# EAGLE design trans-emu (EAGLE 9.6.2)
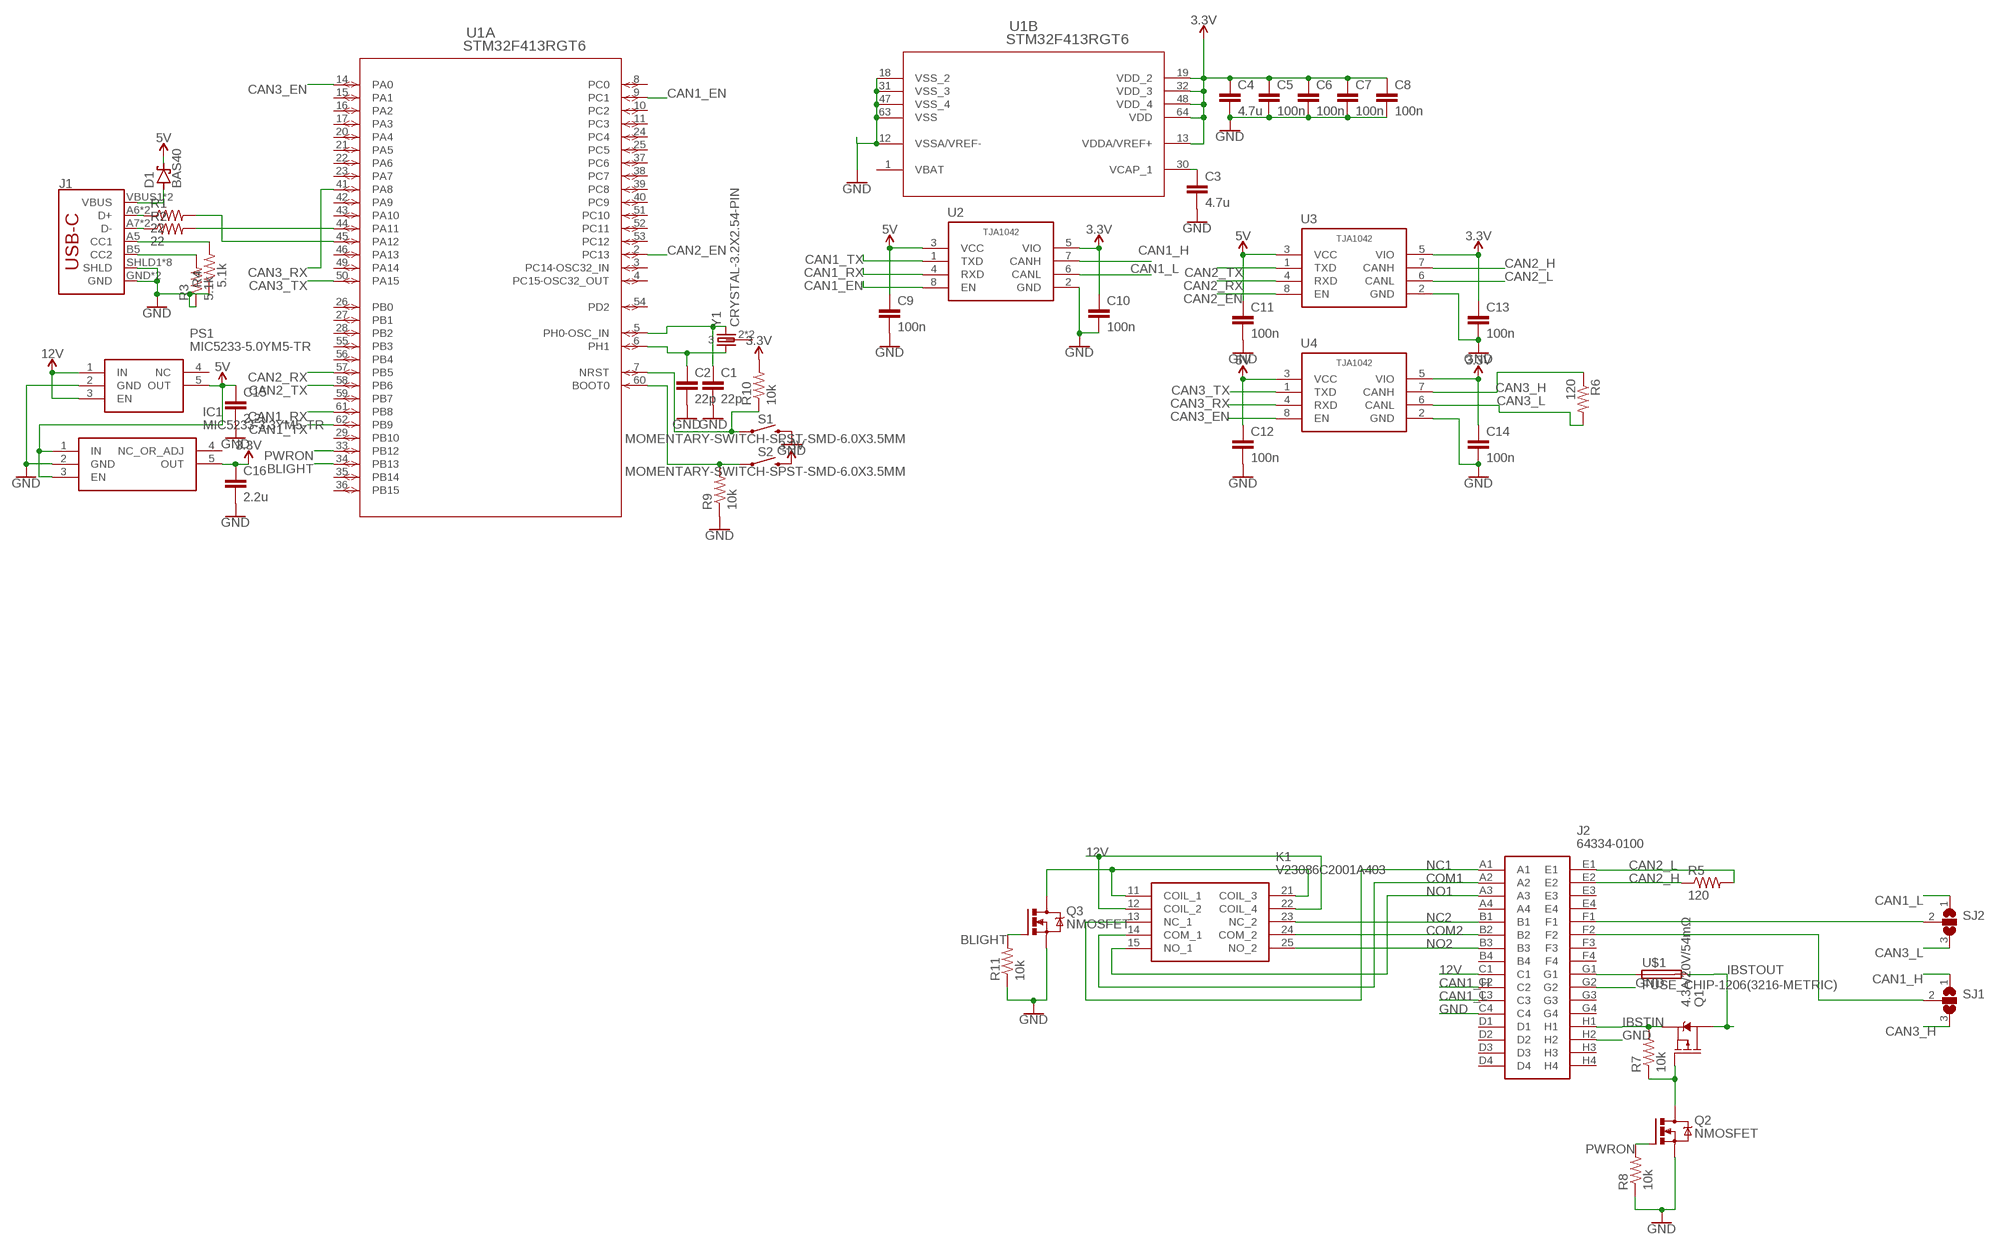
[diagram p0: schematic, sheet 1]

## Parts
C1  22p  C0603  [0603-C]
C2  22p  C0603  [0603-C]
C3  4.7u  C0603  [0603-C]
C4  4.7u  C0603  [0603-C]
C5  100n  C0603  [0603-C]
C6  100n  C0603  [0603-C]
C7  100n  C0603  [0603-C]
C8  100n  C0603  [0603-C]
C9  100n  C0603  [0603-C]
C10  100n  C0603  [0603-C]
C11  100n  C0603  [0603-C]
C12  100n  C0603  [0603-C]
C13  100n  C0603  [0603-C]
C14  100n  C0603  [0603-C]
C15  2.2u  C0603  [0603-C]
C16  2.2u  C0603  [0603-C]
D1  BAS40  [SOT23]
IC1  MIC5233-3.3YM5-TR  [SOT95P280X145-5N]
J1  USB-C-BREAKOUT_SPARKFUN-CONNECTORS_USB_C16PIN  [USB-C-BREAKOUT_SPARKFUN-CONNECTORS_USB-C-16P]
J2  64334-0100  [643340100]
K1  V23086C2001A403  [V23086C2001A403]
PS1  MIC5233-5.0YM5-TR  [SOT95P280X145-5N]
Q1  4.3A/20V/54mΩ  MOSFET_PCH-IRLML2244  [SOT23-3]
Q2  NMOSFET  NMOSFETSOT23  [SOT23]
Q3  NMOSFET  NMOSFETSOT23  [SOT23]
R1  22  R0402  [0402-R]
R2  22  R0402  [0402-R]
R3  5.1k  R0402  [0402-R]
R4  5.1k  R0402  [0402-R]
R5  120  R0402  [0402-R]
R6  120  R0402  [0402-R]
R7  10k  R0402  [0402-R]
R8  10k  R0402  [0402-R]
R9  10k  R0402  [0402-R]
R10  10k  R0402  [0402-R]
R11  10k  R0402  [0402-R]
S1  MOMENTARY-SWITCH-SPST-SMD-6.0X3.5MM  [TACTILE_SWITCH_SMD_6.0X3.5MM]
S2  MOMENTARY-SWITCH-SPST-SMD-6.0X3.5MM  [TACTILE_SWITCH_SMD_6.0X3.5MM]
SJ1  SJ2W  [SJ_2]
SJ2  SJ2W  [SJ_2]
U1  STM32F413RGT6  [LQFP64-10X10MM]
U2  TJA1042  [NXP_SEMICONDUCTORS_TJA1042T-3-CM_118_0]
U3  TJA1042  [NXP_SEMICONDUCTORS_TJA1042T-3-CM_118_0]
U4  TJA1042  [NXP_SEMICONDUCTORS_TJA1042T-3-CM_118_0]
U$1  FUSE_CHIP-1206(3216-METRIC)  [FUSC3215X82N]
Y1  CRYSTAL-3.2X2.54-PIN  [XTAL-3.2X2.5]

## Nets
3.3V: C4.1 C5.1 C6.1 C7.1 C8.1 C10.1 C13.1 C14.1 C16.1 IC1.5(OUT) R10.2 S2.2 U1.13(B:VDDA/VREF+) U1.19(B:VDD_2) U1.32(B:VDD_3) U1.48(B:VDD_4) U1.64(B:VDD) U2.5(VIO) U3.5(VIO) U4.5(VIO)
5V: C9.1 C11.1 C12.1 C15.1 D1.3(C) IC1.1(IN) IC1.3(EN) PS1.5(OUT) U2.3(VCC) U3.3(VCC) U4.3(VCC)
12V: J2.C1 K1.12(COIL_2) K1.22(COIL_4) PS1.1(IN) PS1.3(EN)
BLIGHT: Q3.1(G) R11.2 U1.34(A:PB13)
CAN1_EN: U1.9(A:PC1) U2.8(EN)
CAN1_H: J2.C2 SJ1.1 U2.7(CANH)
CAN1_L: J2.C3 SJ2.1 U2.6(CANL)
CAN1_RX: U1.61(A:PB8) U2.4(RXD)
CAN1_TX: U1.62(A:PB9) U2.1(TXD)
CAN2_EN: U1.2(A:PC13) U3.8(EN)
CAN2_H: J2.E2 R5.1 U3.7(CANH)
CAN2_L: J2.E1 R5.2 U3.6(CANL)
CAN2_RX: U1.57(A:PB5) U3.4(RXD)
CAN2_TX: U1.58(A:PB6) U3.1(TXD)
CAN3_EN: U1.14(A:PA0) U4.8(EN)
CAN3_H: R6.1 SJ1.3 U4.7(CANH)
CAN3_L: R6.2 SJ2.3 U4.6(CANL)
CAN3_RX: U1.41(A:PA8) U4.4(RXD)
CAN3_TX: U1.50(A:PA15) U4.1(TXD)
COM1: J2.A2 K1.14(COM_1)
COM2: J2.B2 K1.24(COM_2)
GND: C1.2 C2.2 C3.2 C4.2 C5.2 C6.2 C7.2 C8.2 C9.2 C10.2 C11.2 C12.2 C13.2 C14.2 C15.2 C16.2 IC1.2(GND) J1.GND J1.GND2(GND) J1.SHLD1(SHLD) J1.SHLD2(SHLD) J1.SHLD3(SHLD) J1.SHLD4(SHLD) J1.SHLD5(SHLD) J1.SHLD6(SHLD) J1.SHLD7(SHLD) J1.SHLD8(SHLD) J2.C4 J2.G2 J2.H2 PS1.2(GND) Q2.2(S) Q3.2(S) R3.1 R4.1 R8.1 R9.1 R11.1 S1.2 U1.12(B:VSSA/VREF-) U1.18(B:VSS_2) U1.31(B:VSS_3) U1.47(B:VSS_4) U1.63(B:VSS) U2.2(GND) U3.2(GND) U4.2(GND)
IBSTIN: J2.H1 Q1.2(S) R7.2
IBSTOUT: Q1.3(D) U$1.2
N$1: C1.1 U1.5(A:PH0-OSC_IN) Y1.3
N$2: C2.1 U1.6(A:PH1) Y1.1
N$3: R2.2 U1.44(A:PA11)
N$4: R1.2 U1.45(A:PA12)
N$5: D1.1(A) J1.VBUS1(VBUS) J1.VBUS2(VBUS)
N$6: J1.A5(CC1) R4.2
N$7: J1.B5(CC2) R3.2
N$8: R10.1 S1.1 U1.7(A:NRST)
N$9: R9.2 S2.1 U1.60(A:BOOT0)
N$10: J1.A6(D+) J1.B6(D+) R1.1
N$11: J1.A7(D-) J1.B7(D-) R2.1
N$12: J2.F2 SJ1.2
N$13: C3.1 U1.30(B:VCAP_1)
N$14: J2.F1 SJ2.2
N$16: Q1.1(G) Q2.3(D) R7.1
N$17: K1.11(COIL_1) K1.21(COIL_3) Q3.3(D)
N$18: J2.G1 U$1.1
NC1: J2.A1 K1.13(NC_1)
NC2: J2.B1 K1.23(NC_2)
NO1: J2.A3 K1.15(NO_1)
NO2: J2.B3 K1.25(NO_2)
PWRON: Q2.1(G) R8.2 U1.33(A:PB12)
Unconnected: IC1.4(NC_OR_ADJ) J2.A4 J2.B4 J2.D1 J2.D2 J2.D3 J2.D4 J2.E3 J2.E4 J2.F3 J2.F4 J2.G3 J2.G4 J2.H3 J2.H4 PS1.4(NC) U1.3(A:PC14-OSC32_IN) U1.4(A:PC15-OSC32_OUT) U1.8(A:PC0) U1.10(A:PC2) U1.11(A:PC3) U1.15(A:PA1) U1.16(A:PA2) U1.17(A:PA3) U1.20(A:PA4) U1.21(A:PA5) U1.22(A:PA6) U1.23(A:PA7) U1.24(A:PC4) U1.25(A:PC5) U1.26(A:PB0) U1.27(A:PB1) U1.28(A:PB2) U1.29(A:PB10) U1.35(A:PB14) U1.36(A:PB15) U1.37(A:PC6) U1.38(A:PC7) U1.39(A:PC8) U1.40(A:PC9) U1.42(A:PA9) U1.43(A:PA10) U1.46(A:PA13) U1.49(A:PA14) U1.51(A:PC10) U1.52(A:PC11) U1.53(A:PC12) U1.54(A:PD2) U1.55(A:PB3) U1.56(A:PB4) U1.59(A:PB7) Y1.2 Y1.4

## Power pins joined to a net without a drawn wire
VBAT: U1.1(B:VBAT)

## Library data of the parts
C1-C16 = comma.ai:C
D1 = diode:BAS40: Silicon Schottky Diodes General-purpose diode for high-speed switching
IC1 = SamacSys_Parts:MIC5233-3.3YM5-TR: High Input Voltage Low IQ UCAP LDO Regulator Source: Datasheet <http://ww1.microchip.com/downloads/en/DeviceDoc/MIC5233-Data-Sheet-DS20006033D.pdf>; DESCRIPTION: High Input Voltage Low IQ UCAP LDO Regulator; HEIGHT: 1.45mm; MANUFACTURER_NAME: Microchip; MANUFACTURER_PART_NUMBER: MIC5233-3.3YM5-TR; MOUSER_PART_NUMBER: 998-MIC5233-3.3YM5TR; MOUSER_PRICE-STOCK: https://www.mouser.co.uk/ProductDetail/Microchip-Technology-Micrel/MIC5233-33YM5-TR?qs=U6T8BxXiZAWDhshLMgpaLQ%3D%3D
J1 = ROTR-Wireless:USB-C-BREAKOUT_SPARKFUN-CONNECTORS_USB_C: USB Type C 16Pin Connector Super Speed pins not available on the 16-pin purely SMD connector so this part is best for USB 2.0 implementations. D1 and D2 are tied together enabling D+/- no matter which way the cable is plugged into the connector. The two channel configuration pins (CC1/2) are exposed. These are normally connected to ground via 5.1k resistors but can be reconfigured for high current/high power applications.; PROD_ID: CONN-14122
J2 = 64334-0100:64334-0100: Molex CMC Series, 64334 Series Number, 4 Row 32 Way Through Hole Plug Header, with Solder Termination Method Source: Datasheet <https://www.molex.com/pdm_docs/sd/643340100_sd.pdf>; DESCRIPTION: Molex CMC Series, 64334 Series Number, 4 Row 32 Way Through Hole Plug Header, with Solder Termination Method; HEIGHT: 24.9mm; MANUFACTURER_NAME: Molex; MANUFACTURER_PART_NUMBER: 64334-0100; MOUSER_PART_NUMBER: 538-64334-0100; MOUSER_PRICE-STOCK: https://www.mouser.co.uk/ProductDetail/Molex/64334-0100/?qs=1v6ai6VCYQB4FZKAqE1dxQ%3D%3D
K1 = SamacSys_Parts:V23086C2001A403: DPDT PCB Mount Non-Latching Relay, 12V dc Source: Datasheet <http://www.te.com/commerce/DocumentDelivery/DDEController?Action=showdoc&DocId=Data SheetV23086-X0000-A0020717pdfEnglishENG_DS_V23086-X0000-A002_0717.pdf1413009-9>; ARROW_PART_NUMBER: V23086C2001A403; ARROW_PRICE-STOCK: http://www.arrow.com/en/products/v23086c2001a403/te-connectivity; DESCRIPTION: DPDT PCB Mount Non-Latching Relay, 12V dc; HEIGHT: 10mm; MANUFACTURER_NAME: TE Connectivity; MANUFACTURER_PART_NUMBER: V23086C2001A403; MOUSER_PART_NUMBER: 571-1413009-9; MOUSER_PRICE-STOCK: https://www.mouser.co.uk/ProductDetail/TE-Connectivity-AMP/V23086C2001A403?qs=NEWnq6vH5Lf200SrWeC2iA%3D%3D
PS1 = SamacSys_Parts:MIC5233-5.0YM5-TR: MICROCHIP - MIC5233-5.0YM5-TR - LDO, REG, 36VIN, 0.1A, 5V, 2%, 5SOT23 Source: Datasheet <https://componentsearchengine.com/Datasheets/2/MIC5233-5.0YM5-TR.pdf>; DESCRIPTION: MICROCHIP - MIC5233-5.0YM5-TR - LDO, REG, 36VIN, 0.1A, 5V, 2%, 5SOT23; HEIGHT: 1.45mm; MANUFACTURER_NAME: Microchip; MANUFACTURER_PART_NUMBER: MIC5233-5.0YM5-TR; MOUSER_PART_NUMBER: 998-MIC5233-5.0YM5TR; MOUSER_PRICE-STOCK: https://www.mouser.co.uk/ProductDetail/Microchip-Technology-Micrel/MIC5233-50YM5-TR?qs=U6T8BxXiZAWSnpCHgrMajw%3D%3D
Q1 = SparkFun-DiscreteSemi:MOSFET_PCH: P-channel MOSFETs Voltage controlled devices that allow control of high current outputs. SparkFun Products: SparkFun ESP32 Thing <https://www.sparkfun.com/products/13907> SparkFun ESP8266 Thing <https://www.sparkfun.com/products/13231>; PROD_ID: TRANS-11153
Q2 Q3 = Transistor:NMOSFET: N-Channel MOSFET - Generic; CATEGORY: Transistor; SUB-CATEGORY: MOSFET; TYPE: N-Channel
R1-R11 = comma.ai:R
S1 S2 = SparkFun-Switches:MOMENTARY-SWITCH-SPST: Momentary Switch (Pushbutton) - SPST Normally-open (NO) SPST momentary switches (buttons, pushbuttons). Variants PTH-12MM - 12mm square, through-hole Momentary Pushbutton Switch - 12mm Square <https://www.sparkfun.com/products/9190> (COM-09190) PTH-6.0MM, PTH-6.0MM-KIT - 6.0mm square, through-hole Mini Pushbutton Switch <https://www.sparkfun.com/products/97> (COM-00097) KIT package intended for soldering kit's - only one side of pads' copper is exposed. PTH-RIGHT-ANGLE-KIT - Right-angle, through-hole Right Angle Tactile Button <https://www.sparkfun.com/products/10791> - Used on SparkFun BigTime Watch Kit <https://www.sparkfun.com/products/11734> SMD-12MM - 12mm square, surface-mount Tactile Button - SMD (12mm) <https://www.sparkfun.com/products/12993> (COM-12993) Used on SparkFun PicoBoard <https://www.sparkfun.com/products/11888> SMD-4.5MM - 4.5mm Square Trackball Switch Used on SparkFun Blackberry Trackballer Breakout <https://www.sparkfun.com/products/13169> SMD-4.6MMX2.8MM - 4.60mm x 2.80mm, surface mount Used on SparkFun SAMD21 Mini Breakout <https://www.sparkfun.com/products/13664> SMD-5.2MM, SMD-5.2-REDUNDANT - 5.2mm square, surface-mount Mini Pushbutton Switch - SMD <https://www.sparkfun.com/products/8720> (COM-08720) Used on Arduino Pro Mini <https://www.sparkfun.com/products/11114> REDUNDANT package connects both switch circuits together SMD-6.0X3.5MM - 6.0 x 3.5mm, surface mount Momentary Reset Switch SMD <https://www.sparkfun.com/products/8229> (COM-08229) SMD-6.2MM-TALL - 6.2mm square, surface mount Tactile Button - SMD (6mm) <https://www.sparkfun.com/products/12992> Used on SparkFun Digital Sandbox <https://www.sparkfun.com/products/12651> SMD-RIGHT-ANGLE - Right-angle, surface mount Used on SparkFun Block for Intel® Edison - Arduino <https://www.sparkfun.com/products/13036>; PROD_ID: SWCH-00815; SF_SKU: COM-08229
SJ1 SJ2 = jumper:SJ2W: SMD solder JUMPER
U1 = interceptor:STM32F413RGT6; BUILT_BY: EMA_UL_Team; COPYRIGHT: Copyright (C) 2018 Accelerated Designs. All rights reserved; MANUFACTURER_PART_NUMBER: STM32F413RGT6; SOURCELIBRARY: Updates_to_database_2020-10-19; VENDOR: STMicroelectronics
U2-U4 = CM,118:TJA1042
U$1 = Circuit-Protection:FUSE: Fuse - Generic; CATEGORY: Circuit-Protection; SUB-CATEGORY: Fuse
Y1 = comma.ai:CRYSTAL-3.2X2.5

## Board
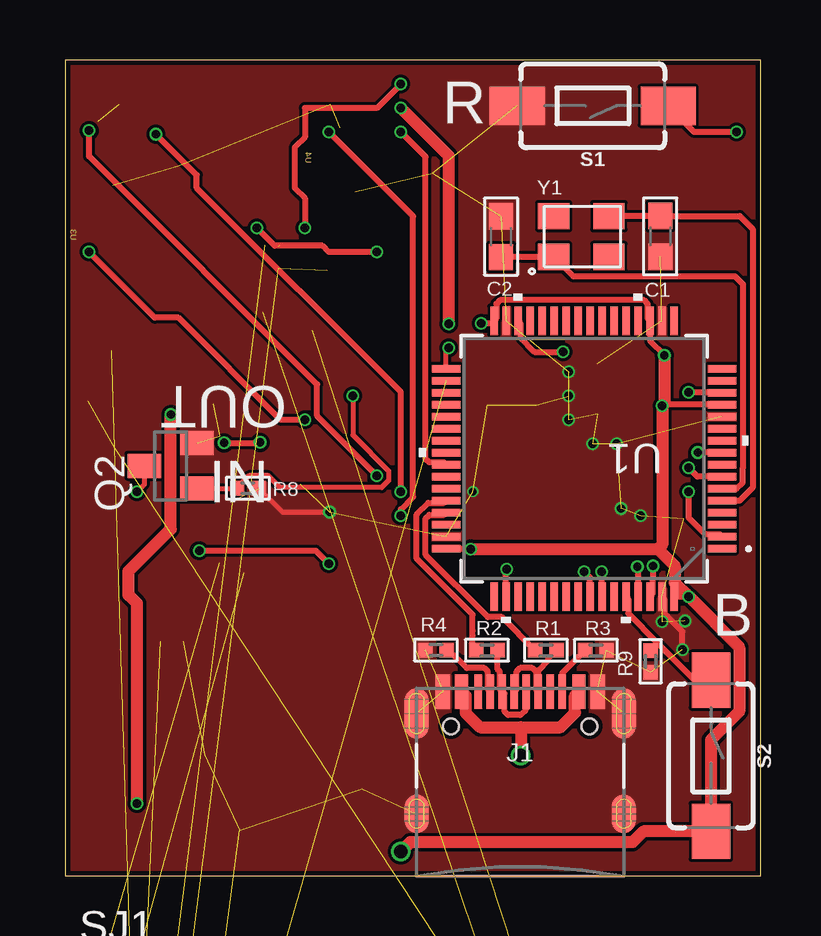
[diagram p1: board, top side]
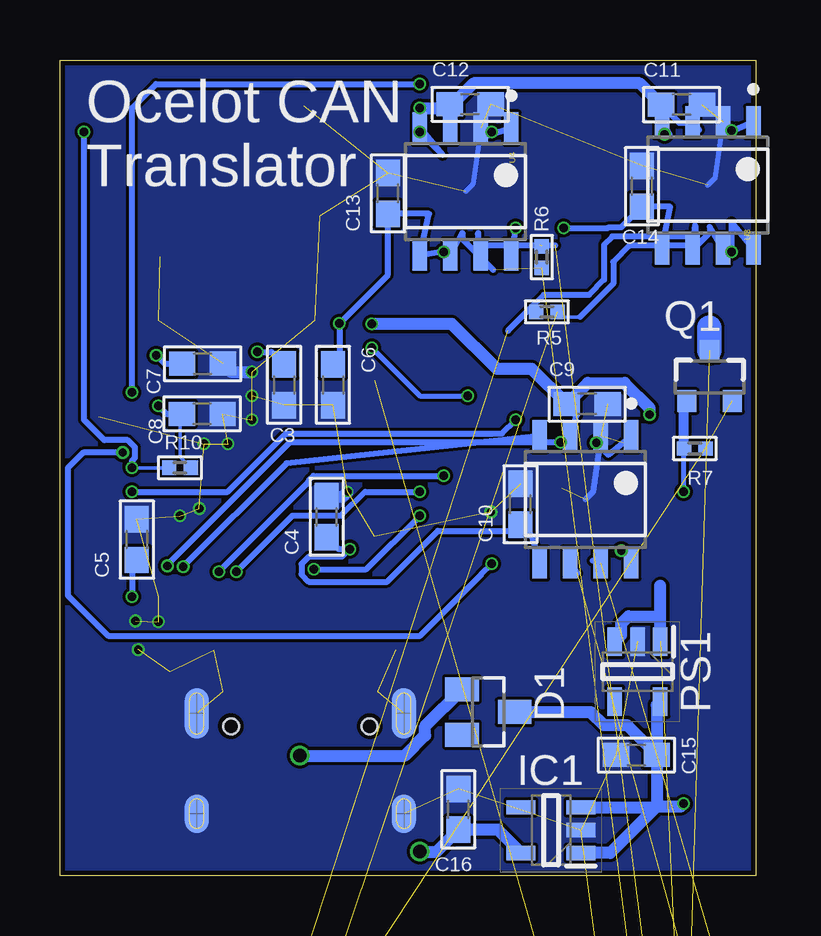
[diagram p2: board, bottom side, seen from below]

Size 29 x 34 mm. Coordinates in mm from the lower left corner, seen from the top.
Outline: 0,0 29,0 29,34 0,34 0,0
Copper layers (1*16): Top 0.035559375mm / dielectric 1.6mm / Bottom 0.035559375mm
Design rules "jlcpcb2layer": minimum track width 5mil, minimum drill 12mil, track to track 5mil, track to pad 5mil, pad to pad 5mil, via to via 5mil, smd to smd 5mil, copper to edge 8mil, drill to drill 6mil, minimum pad ring 5mil, minimum via ring 3mil, stop-mask expansion 2.5mil, vias tented up to drill 0mil, thermal gap 10mil

### Footprints (pad centres in the part's own frame; a part is rotated, then mirrored left to right if it is on the bottom)
0603-C = smd 1.1 x 1: 1 -0.85,0; 2 0.85,0
SOT23 = smd 1 x 1.4: 1 -0.95,-1.1; 2 0.95,-1.1; 3 0,1.1
SOT95P280X145-5N = smd 1.2 x 0.6: 1 -1.25,0.95; 2 -1.25,0; 3 -1.25,-0.95; 4 1.25,-0.95; 5 1.25,0.95
USB-C-BREAKOUT_SPARKFUN-CONNECTORS_USB-C-16P = smd 0.3 x 1.45: A5 -1.25,0; A6 -0.25,0; A7 0.25,0; A8 1.25,0; B5 1.75,0; B6 0.75,0; B7 -0.75,0; B8 -1.75,0 | smd 0.6 x 1.45: GND -3.225,0; GND2 3.225,0 | smd 1 x 2.1: SHLD1 -4.32,-0.915; SHLD2 4.32,-0.915 | smd 1 x 2.1 bottom: SHLD3 -4.32,-0.915; SHLD4 4.32,-0.915 | smd 1 x 1.6: SHLD5 -4.32,-5.095; SHLD8 4.32,-5.095 | smd 1 x 1.6 bottom: SHLD6 -4.32,-5.095; SHLD7 4.32,-5.095 | smd 0.55 x 1.45: VBUS1 -2.45,0; VBUS2 2.45,0 | hole 0.65: -2.89,-1.445; 2.89,-1.445
643340100 = drill 1.3 pad 1.95: A1 0,0; A2 0,-2.5; A3 0,-5; A4 0,-7.5; B1 2.5,0; B2 2.5,-2.5; B3 2.5,-5; B4 2.5,-7.5; C1 5,0; C2 5,-2.5; C3 5,-5; C4 5,-7.5; D1 7.5,0; D2 7.5,-2.5; D3 7.5,-5; D4 7.5,-7.5; E1 10,0; E2 10,-2.5; E3 10,-5; E4 10,-7.5; F1 12.5,0; F2 12.5,-2.5; F3 12.5,-5; F4 12.5,-7.5; G1 16,0; G2 16,-2.5; G3 16,-5; G4 16,-7.5; H1 19.7,0; H2 19.7,-2.5; H3 19.7,-5; H4 19.7,-7.5 | hole 2.3: -6.45,1; 26.15,1 | hole 4.1: -10.55,-2.85; 30.25,-2.85
V23086C2001A403 = drill 1.11 pad 1.665: 11 -2.585,-1.909; 12 -10.085,4.691; 21 2.585,1.091; 22 10.085,-5.509 | drill 1.45 pad 2.175: 13 -9.585,-5.509; 14 -1.585,-5.509; 23 9.585,4.751; 24 1.585,4.751; 25 9.585,1.751 | drill 1.25 pad 1.875: 15 -9.585,-2.509
SOT23-3 = smd 0.8 x 0.9: 1 -0.95,-1; 2 0.95,-1; 3 0,1.1
0402-R = smd 0.6 x 0.6: 1 -0.45,0; 2 0.45,0
TACTILE_SWITCH_SMD_6.0X3.5MM = smd 2.3 x 1.6: 1 -3.15,0; 2 3.15,0
SJ_2 = smd 1.168 x 1.6: 1 -1.524,0; 2 0,0; 3 1.524,0
LQFP64-10X10MM = smd 1.194 x 0.305: 1 -5.75,3.75; 2 -5.75,3.25; 3 -5.75,2.75; 4 -5.75,2.25; 5 -5.75,1.75; 6 -5.75,1.25; 7 -5.75,0.75; 8 -5.75,0.25; 9 -5.75,-0.25; 10 -5.75,-0.75; 11 -5.75,-1.25; 12 -5.75,-1.75; 13 -5.75,-2.25; 14 -5.75,-2.75; 15 -5.75,-3.25; 16 -5.75,-3.75; 33 5.75,-3.75; 34 5.75,-3.25; 35 5.75,-2.75; 36 5.75,-2.25; 37 5.75,-1.75; 38 5.75,-1.25; 39 5.75,-0.75; 40 5.75,-0.25; 41 5.75,0.25; 42 5.75,0.75; 43 5.75,1.25; 44 5.75,1.75; 45 5.75,2.25; 46 5.75,2.75; 47 5.75,3.25; 48 5.75,3.75 | smd 0.305 x 1.194: 17 -3.75,-5.75; 18 -3.25,-5.75; 19 -2.75,-5.75; 20 -2.25,-5.75; 21 -1.75,-5.75; 22 -1.25,-5.75; 23 -0.75,-5.75; 24 -0.25,-5.75; 25 0.25,-5.75; 26 0.75,-5.75; 27 1.25,-5.75; 28 1.75,-5.75; 29 2.25,-5.75; 30 2.75,-5.75; 31 3.25,-5.75; 32 3.75,-5.75; 49 3.75,5.75; 50 3.25,5.75; 51 2.75,5.75; 52 2.25,5.75; 53 1.75,5.75; 54 1.25,5.75; 55 0.75,5.75; 56 0.25,5.75; 57 -0.25,5.75; 58 -0.75,5.75; 59 -1.25,5.75; 60 -1.75,5.75; 61 -2.25,5.75; 62 -2.75,5.75; 63 -3.25,5.75; 64 -3.75,5.75
NXP_SEMICONDUCTORS_TJA1042T-3-CM_118_0 = smd 1.3 x 0.6: 1 -2.65,1.905; 2 -2.65,0.635; 3 -2.65,-0.635; 4 -2.65,-1.905; 5 2.65,-1.905; 6 2.65,-0.635; 7 2.65,0.635; 8 2.65,1.905
FUSC3215X82N = smd 1.165 x 1.814: 1 -1.475,0; 2 1.475,0
XTAL-3.2X2.5 = smd 1.3 x 1.1: 1 0,-1.8; 2 2.3,-1.8; 3 2.3,-0.1; 4 0,-0.1

### Placement (x,y rotation side)
C1  24.81,26.65 270 top
C2  18.18,26.63 90 top
C3  19.65,20.45 270 bottom
C4  17.88,14.96 90 bottom
C5  25.79,14.01 90 bottom
C6  17.62,20.45 270 bottom
C7  23.06,21.33 0 bottom
C8  23.07,19.25 0 bottom
C9  7.02,19.65 0 bottom
C10  9.8,15.48 90 bottom
C11  3.08,32.13 0 bottom
C12  11.9,32.15 0 bottom
C13  15.33,28.44 90 bottom
C14  4.73,28.73 90 bottom
C15  4.96,5.03 180 bottom
C16  12.39,2.76 90 bottom
D1  11.14,6.82 270 bottom
IC1  8.53,1.89 180 bottom
J1  18.98,7.67 0 top
J2  21,-41 0 top  (outside the outline)
K1  13,-18 0 top  (outside the outline)
PS1  4.92,8.5 270 bottom
Q1  1.92,20.78 0 bottom
Q2  4.4,17.08 90 top
Q3  2,-30 0 top  (outside the outline)
R1  20.05,9.39 180 top
R2  17.59,9.39 180 top
R3  22.13,9.39 180 top
R4  15.46,9.4 0 top
R5  8.7,23.5 180 bottom
R6  8.91,25.78 270 bottom
R7  2.53,17.8 0 bottom
R8  7.63,16.14 180 top
R9  24.42,8.93 90 top
R10  24,17 0 bottom
R11  1,-36 0 top  (outside the outline)
S1  22,32.09 180 top
S2  26.93,4.99 270 top
SJ1  3,-4 0 top  (outside the outline)
SJ2  3,-9 0 top  (outside the outline)
U1  21.64,17.38 180 top
U2  7.09,15.68 270 bottom
U3  2,28.77 270 bottom
U4  12.09,28.52 270 bottom
U$1  4,-93 0 top  (outside the outline)
Y1  20.37,27.59 0 top

### Tracks (layer width: path | path; a pad name or v marks a point on that pad's centre or on a via)
3.3V  (via drill 0.35, 0.55)
  Top 0.254: U1.64 v26,11.63 | v17.35,23.02 17.78,23.02 U1.32 17.98,23.22 17.98,23.83 18.13,23.98 24.15,23.98 24.3,23.83 24.3,23.22 U1.19 24.39,22.29 v24.99,21.69 | U1.13 24.94,19.63 v24.9,19.59 | v16.92,13.61 15.91,13.61 U1.48 | v13,26 10.99,26 10.74,26.25 8.75,26.25 v8,27
  Top 0.508: v16.92,13.61 24.72,13.61 | 24.72,13.61 25.42,12.91 25.42,12.21 v26,11.63 28.11,9.52 28.11,6.83 26.93,5.65 S2.2 24.11,1.84 23.66,1.39 14.39,1.39 v14,1 | 24.72,13.61 24.9,13.79 v24.9,19.59 24.99,19.68 v24.99,21.69
  Bottom 0.152: R10.2 24,17.45 24,19.25
  Bottom 0.254: U3.5 3.56,27.88 C14.1 5.59,27.02 6.13,27.02 6.15,27 v8,27 | U2.5 9.35,14.18 C10.1 10.06,14.37 13.24,14.37 15.36,12.25 18.63,12.25 18.93,12.55 18.93,12.98 18.63,13.28 17.25,13.28 v16.92,13.61 17.39,13.61 C4.1 | C6.1 17.35,21.57 v17.35,23.02 15.33,25.04 C13.1 13.61,27.59 U4.5 13.04,26.04 v13,26 | v24.99,21.69 24.63,21.33 C7.1 | v24.9,19.59 24.56,19.25 24,19.25 C8.1 | C5.1 26,12.95 v26,11.63
  Bottom 0.508: IC1.5 10.74,1.91 C16.1 13.3,1 v14,1
5V  (via drill 0.35)
  Top 0.508: v3,3 3,11.34 2.65,11.69 2.65,12.69 4.41,14.45 v4.41,19.22 | v16,23 16,30 v14,32
  Bottom 0.254: U4.3 12.44,31.84 C12.1 | C11.1 3.18,31.38 2.64,31.38 2.35,31.08 U3.3 | U2.3 7.44,19.22 C9.1
  Bottom 0.508: PS1.5 4.12,7.11 C15.1 | C15.1 4.12,2.88 | IC1.1 6.06,0.94 4.16,2.84 | IC1.3 4.16,2.84 | 4.16,2.84 4.12,2.88 | D1.3 6.88,6.82 6.33,6.27 5.36,6.27 C15.1 | C11.1 4.83,33.03 11.76,33.03 12.64,32.15 C12.1 12.9,32 v14,32 | 4.12,2.88 3.12,2.88 v3,3 | v4.41,19.22 4.41,19.48 5.46,20.53 6.99,20.53 C9.1 9.34,21.12 10.79,21.12 12.67,23 v16,23
12V  (3 unrouted)
  Bottom 0.508: PS1.1 3.97,10.81 | 3.97,10.81 3.97,12.08 | PS1.3 5.6,10.02 5.6,10.51 5.3,10.81 3.97,10.81
BLIGHT  (2 unrouted)
CAN1_EN  (via drill 0.35)
  Top 0.254: U1.9 v26.39,17.63 v26.39,17.64 | v11,13 10.46,13.54 v5.6,13.54
  Bottom 0.254: v26.39,17.64 28.04,17.64 28.67,17 28.67,11.67 27,10 13.99,10 11.43,12.56 11.43,12.57 v11,13 | v5.6,13.54 5.6,13.64 U2.8
CAN1_H  (2 unrouted)
  Bottom 0.254: U2.7 6.79,13.12
CAN1_L  (2 unrouted)
  Bottom 0.254: U2.6 7.44,12.61
CAN1_RX  (via drill 0.35)
  Top 0.254: v23.86,12.88 23.89,12.85 U1.61
  Bottom 0.254: U2.4 19.56,17.18 v23.86,12.88
CAN1_TX  (via drill 0.35)
  Top 0.254: v6.63,18.03 8.11,18.03 v8.13,18.05 | v24.52,12.91 24.52,12.36 24.48,12.33 24.48,11.72 U1.62
  Bottom 0.254: U2.1 6.14,17.54 v6.63,18.03 | v24.52,12.91 24.38,13.04 24.38,13.09 19.42,18.05 v8.13,18.05
CAN2_EN  (via drill 0.35)
  Top 0.254: U1.2 27.3,14.22 26.69,14.22 26,14.91 v26,16 | v1,26 3.75,23.25 4.74,23.25 8.99,19 v10,19
  Bottom 0.254: v26,16 22.01,16 19.57,18.43 10.56,18.43 v10,19 | v1,26 1,27.23 U3.8
CAN2_H  (1 unrouted)
  Bottom 0.152: R5.1 8.04,23.29 7.32,23.29
  Bottom 0.254: U3.7 1.92,27.05 1.92,26.79 2.45,26.26 5.25,26.26 5.93,25.57 5.93,24.68 7.32,23.29
CAN2_L  (1 unrouted)
  Bottom 0.152: R5.2 9.32,23.67 9.37,23.67
  Bottom 0.254: U3.6 2.52,27.1 2.52,26.79 2.67,26.64 5.97,26.64 6.32,26.3 6.32,24.83 6.94,24.21 8.83,24.21 9.37,23.67 10.32,22.72
CAN2_RX  (via drill 0.35)
  Top 0.254: U1.57 21.89,12.42 v21.64,12.67 | v3.79,30.9 5.49,29.2 5.49,28.66 14,20.15 v14,16
  Bottom 0.254: v21.64,12.67 19.31,15 17.27,15 16.27,16 v14,16 | v3.79,30.9 3.58,30.9 U3.4
CAN2_TX  (via drill 0.35)
  Top 0.254: U1.58 22.39,12.65 v22.37,12.67 | v13,16.66 10.52,19.15 10.52,20.47 1,29.98 v1,31.06
  Bottom 0.254: v22.37,12.67 18.63,16.41 18.63,16.46 18.43,16.66 v13,16.66 | v1,31.06 1.04,31.02 U3.1
CAN3_EN  (via drill 0.35)
  Top 0.254: U1.14 26.02,20.13 v26,20.15 | v14,33 13,32 10,32 10,30.79 9.57,30.36 9.57,28.66 10,28.23 v10,27
  Bottom 0.254: v26,20.15 26,32 25,33 v14,33 | v10,27 10.02,27.02 U4.8
CAN3_H  (2 unrouted)
  Bottom 0.152: 8.96,26.28 9,26.28
  Bottom 0.254: U4.7 11.57,26.8 11.57,26.54 11.31,26.28 9,26.28 8.35,26.28
CAN3_L  (2 unrouted)
  Bottom 0.254: U4.6 12.22,26.8 12.22,26.54 10.93,25.25
CAN3_RX  (via drill 0.35)
  Top 0.254: U1.41 15.8,17.22 15.19,17.22 15.04,17.37 15.04,29.96 v14,31
  Bottom 0.254: v14,31 13.04,30.04 U4.4
CAN3_TX  (via drill 0.35)
  Top 0.254: U1.50 18.39,12.74 v18.41,12.77 | v14,15 14,15.27 14.52,15.79 14.52,27.48 v11,31
  Bottom 0.254: v18.41,12.77 16.23,12.77 v14,15 | v11,31 11.14,30.86 U4.1
COM1  (1 unrouted)
COM2  (1 unrouted)
GND  (via drill 0.3, 0.35)  (47 unrouted)
  Top 0.203: R8.1 9.06,15.16 v11.03,15.16
  Top 0.254: U1.63 24.98,11.54 24.98,10.93 25.74,10.17 v25.74,9.42
  Bottom 0.2: U3.2 1.7,29.07 2,28.77 | U4.2 11.79,28.82 12.09,28.52
  Bottom 0.203: v11.03,15.16 11.03,15.03 11,15
  Bottom 0.254: U2.2 6.79,15.98 7.09,15.68
  Bottom 0.508: C7.2 21.87,21 v21,21 | C4.2 17.2,15.81 v17,16
  other vias: 21,20 21,19 22,18 23,18 24.89,10.58 24,15 23.19,15.3 25.85,10.61
  pour Bottom (no thermals): 0,34 29,34 29,0 0,0
  pour Top (no thermals): 0,0 0,34 29,34 29,0
IBSTIN  (2 unrouted)
IBSTOUT  (1 unrouted)
  Bottom 1.016: Q1.3 1.92,22.85
N$1
  Top 0.254: Y1.3 22.68,27.5 C1.1 28.12,27.5 28.67,26.95 28.67,16.17 28.12,15.62 27.4,15.62 U1.5
N$2
  Top 0.254: C2.1 Y1.1 21.18,24.98 27.93,24.98 28.26,24.65 28.26,17 28.24,16.98 28.24,16.37 28,16.13 U1.6
N$3
  Top 0.254: R2.2 16.99,9.54 16.99,10 16.99,10.2 16.99,10.88 14.66,13.21 14.66,15.04 15.15,15.54 15.8,15.54 U1.44
N$4
  Top 0.254: R1.2 18.21,10.78 17.63,10.78 15.04,13.37 15.04,14.89 15.19,15.04 15.8,15.04 U1.45
N$5  (via drill 0.55)
  Top 0.508: J1.VBUS1 16.7,7.5 16.7,6.79 17.3,6.18 19,6.18 | J1.VBUS2 21.26,7.5 21.26,6.79 20.66,6.18 19,6.18 | 19,6.18 v19,5
  Bottom 0.508: D1.1 13.78,6.23 13.78,5.84 14.62,5 v19,5
N$6
  Top 0.254: R4.2 16,9.4 16.75,8.65 17.48,8.65 17.63,8.5 17.63,7.77 J1.A5
N$7
  Top 0.254: J1.B5 20.73,8.44 R3.2
N$8  (via drill 0.35)
  Top 0.254: U1.7 26.37,16.63 v26,17 | v28,31 26.23,31 S1.1
  Bottom 0.152: R10.1 v26,17
  Bottom 0.254: v26,17 26,17.29 25.87,17.42 25.87,17.85 26.17,18.15 27.15,18.15 28,19 v28,31
N$9
  Top 0.152: R9.2 24.42,9.42 24.71,9.71
  Top 0.254: U1.60 23.48,11.54 23.48,10.93 24.71,9.71 26.27,8.14 S2.1
N$10
  Top 0.254: J1.A6 18.83,7.77 18.83,8.5 18.98,8.65 19.48,8.65 19.63,8.5 19.63,7.77 J1.B6 19.73,8.56 20.15,8.98 20.15,9.04 R1.1
N$11
  Top 0.254: J1.A7 19.21,7.65 19.21,6.91 18.98,6.69 18.48,6.69 18.33,6.84 18.33,7.57 J1.B7 18.13,7.77 18.13,8.5 18.04,8.59 R2.1
N$12  (1 unrouted)
N$13  (via drill 0.35)
  Top 0.254: U1.30 18.98,23.04 18.98,22.43 19.58,21.83 v20.77,21.83
  Bottom 0.254: v20.77,21.83 20.18,21.83 C3.1
N$14  (1 unrouted)
N$16  (via drill 0.35)
  Top 0.203: Q2.3 3.3,16.3 v3,16
  Bottom 0.203: v3,16 2.98,16.02 R7.1
  Bottom 0.406: R7.1 2.98,19.57 Q1.1
N$17  (2 unrouted)
N$18  (1 unrouted)
NC1  (1 unrouted)
NC2  (1 unrouted)
NO1  (1 unrouted)
NO2  (1 unrouted)
PWRON  (via drill 0.35)
  Top 0.203: 7.13,16.13 7.16,16.13 R8.2 | U1.33 15.89,21.89 v16,22 | 7.13,16.13 7,16.13 | 7.13,16.13 7.68,16.67 8.47,16.67 8.97,16.17 13.2,16.17 13.49,16.46 13.49,16.87 12,18.36 v12,20 | Q2.1 7.13,16.13
  Bottom 0.203: v16,22 14,20 v12,20

### Text on the board
tNames: R | OUT | IN | B
bNames: Ocelot CAN / Translator